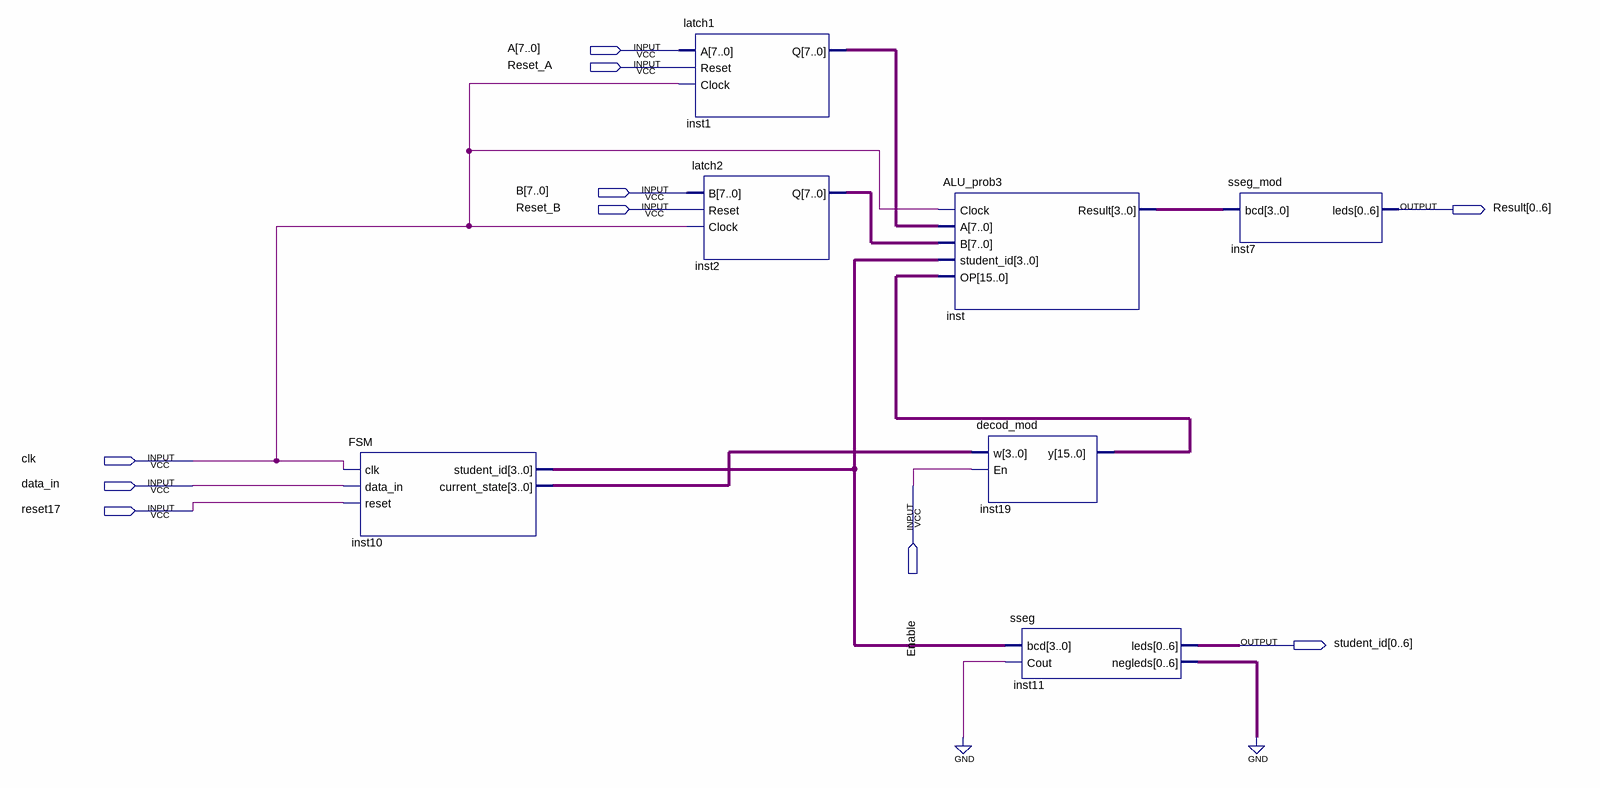
[diagram p0: schematic sheet]
// Quartus schematic GPU_prob3.bdf as structural Verilog: 7 symbols, 10 pins
module GPU_prob3 (
  input  [7:0] A,
  input  Reset_A,
  input  [7:0] B,
  input  Reset_B,
  input  clk,
  input  data_in,
  input  Enable,
  input  reset17,
  output [0:6] Result,
  output [0:6] student_id
);

  wire [3:0] inst10_current_state, inst10_student_id, inst_result;
  wire [6:0] inst11_negleds;
  wire [7:0] inst1_q, inst2_q;
  wire [15:0] inst19_y;

  FSM inst10 (
    .clk(clk), .data_in(data_in), .reset(reset17), .student_id(inst10_student_id),
    .current_state(inst10_current_state));
  latch1 inst1 (.A(A), .Reset(Reset_A), .Clock(clk), .Q(inst1_q));
  latch2 inst2 (.B(B), .Reset(Reset_B), .Clock(clk), .Q(inst2_q));
  ALU_prob3 inst (
    .Clock(clk), .A(inst1_q), .B(inst2_q), .student_id(inst10_student_id), .OP(inst19_y), .Result(inst_result));
  decod_mod inst19 (.w(inst10_current_state), .En(Enable), .y(inst19_y));
  sseg inst11 (.bcd(inst10_student_id), .Cout(1'b0), .leds(student_id), .negleds(inst11_negleds));
  sseg_mod inst7 (.bcd(inst_result), .leds(Result));
  // also tied to GND on the sheet: {inst11_negleds[0], inst11_negleds[1], inst11_negleds[2], inst11_negleds[3], inst11_negleds[4], inst11_negleds[5], inst11_negleds[6]}
endmodule
